# Altium schematic sheet TX.SchDoc
size A; SheetNumber: 3; SheetTotal: 7
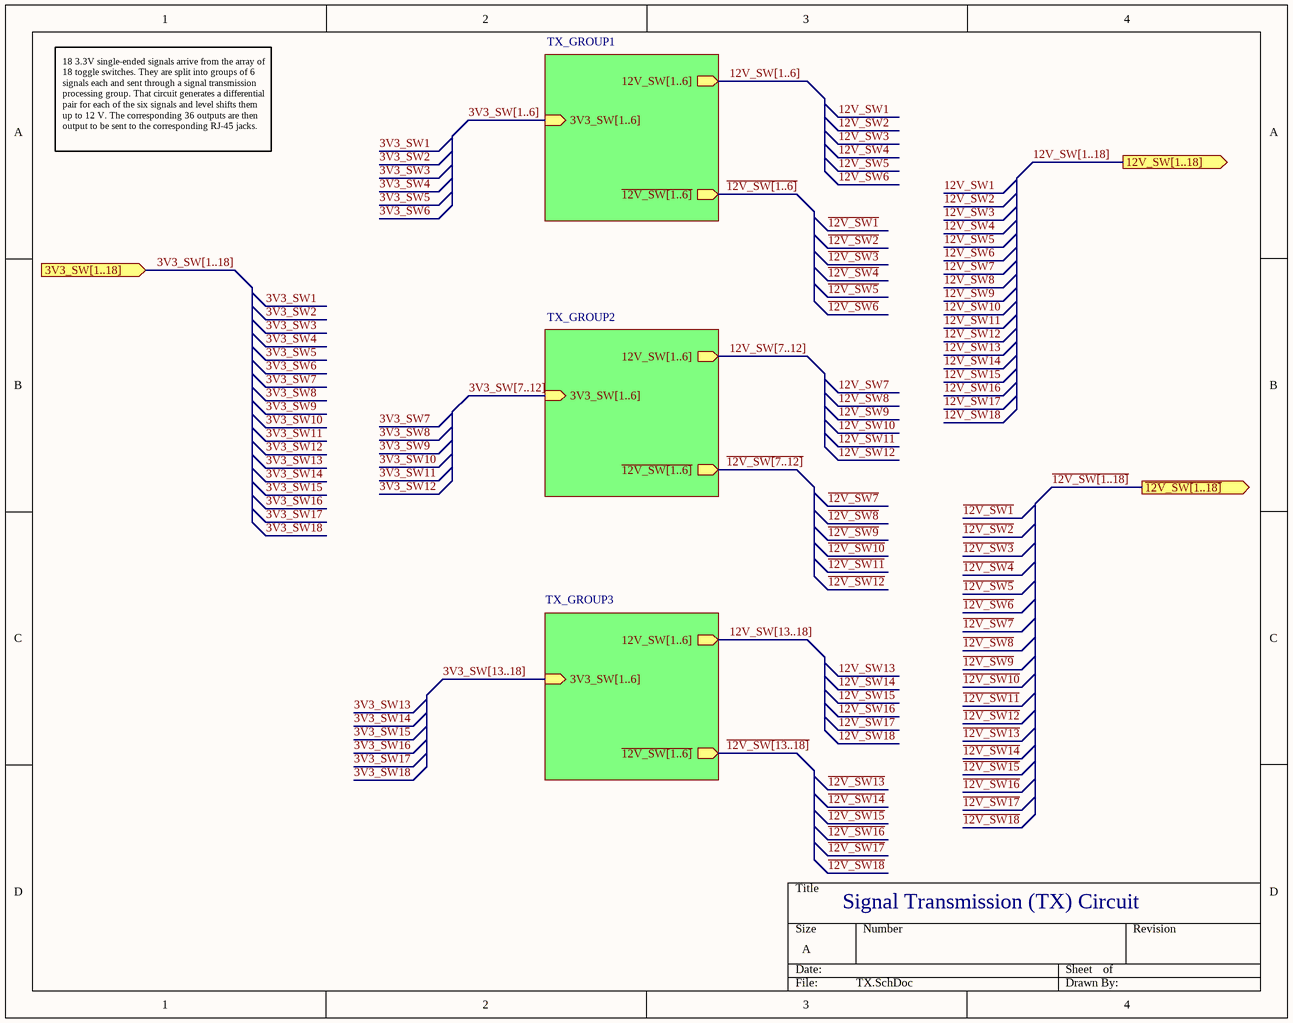
[diagram p0: TX.SchDoc]

## Sub-sheets
TX_GROUP1 = TX_GROUP.SchDoc: 3V3_SW[1..6] (in), ~{12V_SW[1..6]} (out), 12V_SW[1..6] (out)
TX_GROUP2 = TX_GROUP.SchDoc: 3V3_SW[1..6] (in), ~{12V_SW[1..6]} (out), 12V_SW[1..6] (out)
TX_GROUP3 = TX_GROUP.SchDoc: 3V3_SW[1..6] (in), ~{12V_SW[1..6]} (out), 12V_SW[1..6] (out)

## Ports
3V3_SW[1..18] (in, see Load_Bank_Master[3C], TX_GROUP[1A]), 12V_SW[1..18] (out, see Load_Bank_Master[4C], Jacks[1A], TX_GROUP[4B]), ~{12V_SW[1..18]} (out, see Load_Bank_Master[4C], Jacks[1B], TX_GROUP[4A])

## Buses and harness runs
bus 3V3_SW[1..6] = sheet TX_GROUP1/3V3_SW[1..6]
bus 3V3_SW[1..18] = port 3V3_SW[1..18]
bus 3V3_SW[7..12] = sheet TX_GROUP2/3V3_SW[1..6]
bus 3V3_SW[13..18] = sheet TX_GROUP3/3V3_SW[1..6]
bus 12V_SW[1..6] = sheet TX_GROUP1/12V_SW[1..6]
bus 12V_SW[1..18] = port 12V_SW[1..18]
bus 12V_SW[7..12] = sheet TX_GROUP2/12V_SW[1..6]
bus 12V_SW[13..18] = sheet TX_GROUP3/12V_SW[1..6]
bus ~{12V_SW[1..6]} = sheet TX_GROUP1/~{12V_SW[1..6]}
bus ~{12V_SW[1..18]} = port ~{12V_SW[1..18]}
bus ~{12V_SW[7..12]} = sheet TX_GROUP2/~{12V_SW[1..6]}
bus ~{12V_SW[13..18]} = sheet TX_GROUP3/~{12V_SW[1..6]}

## Notes on the sheet
- 18 3.3V single-ended signals arrive from the array of 18 toggle switches. They are split into groups of 6 signals each and sent through a signal transmission processing group. That circuit generates a differential pair for each of the six signals and level shifts them up to 12 V. The corresponding 36 outputs are then output to be sent to the corresponding RJ-45 jacks.
- Signal Transmission (TX) Circuit